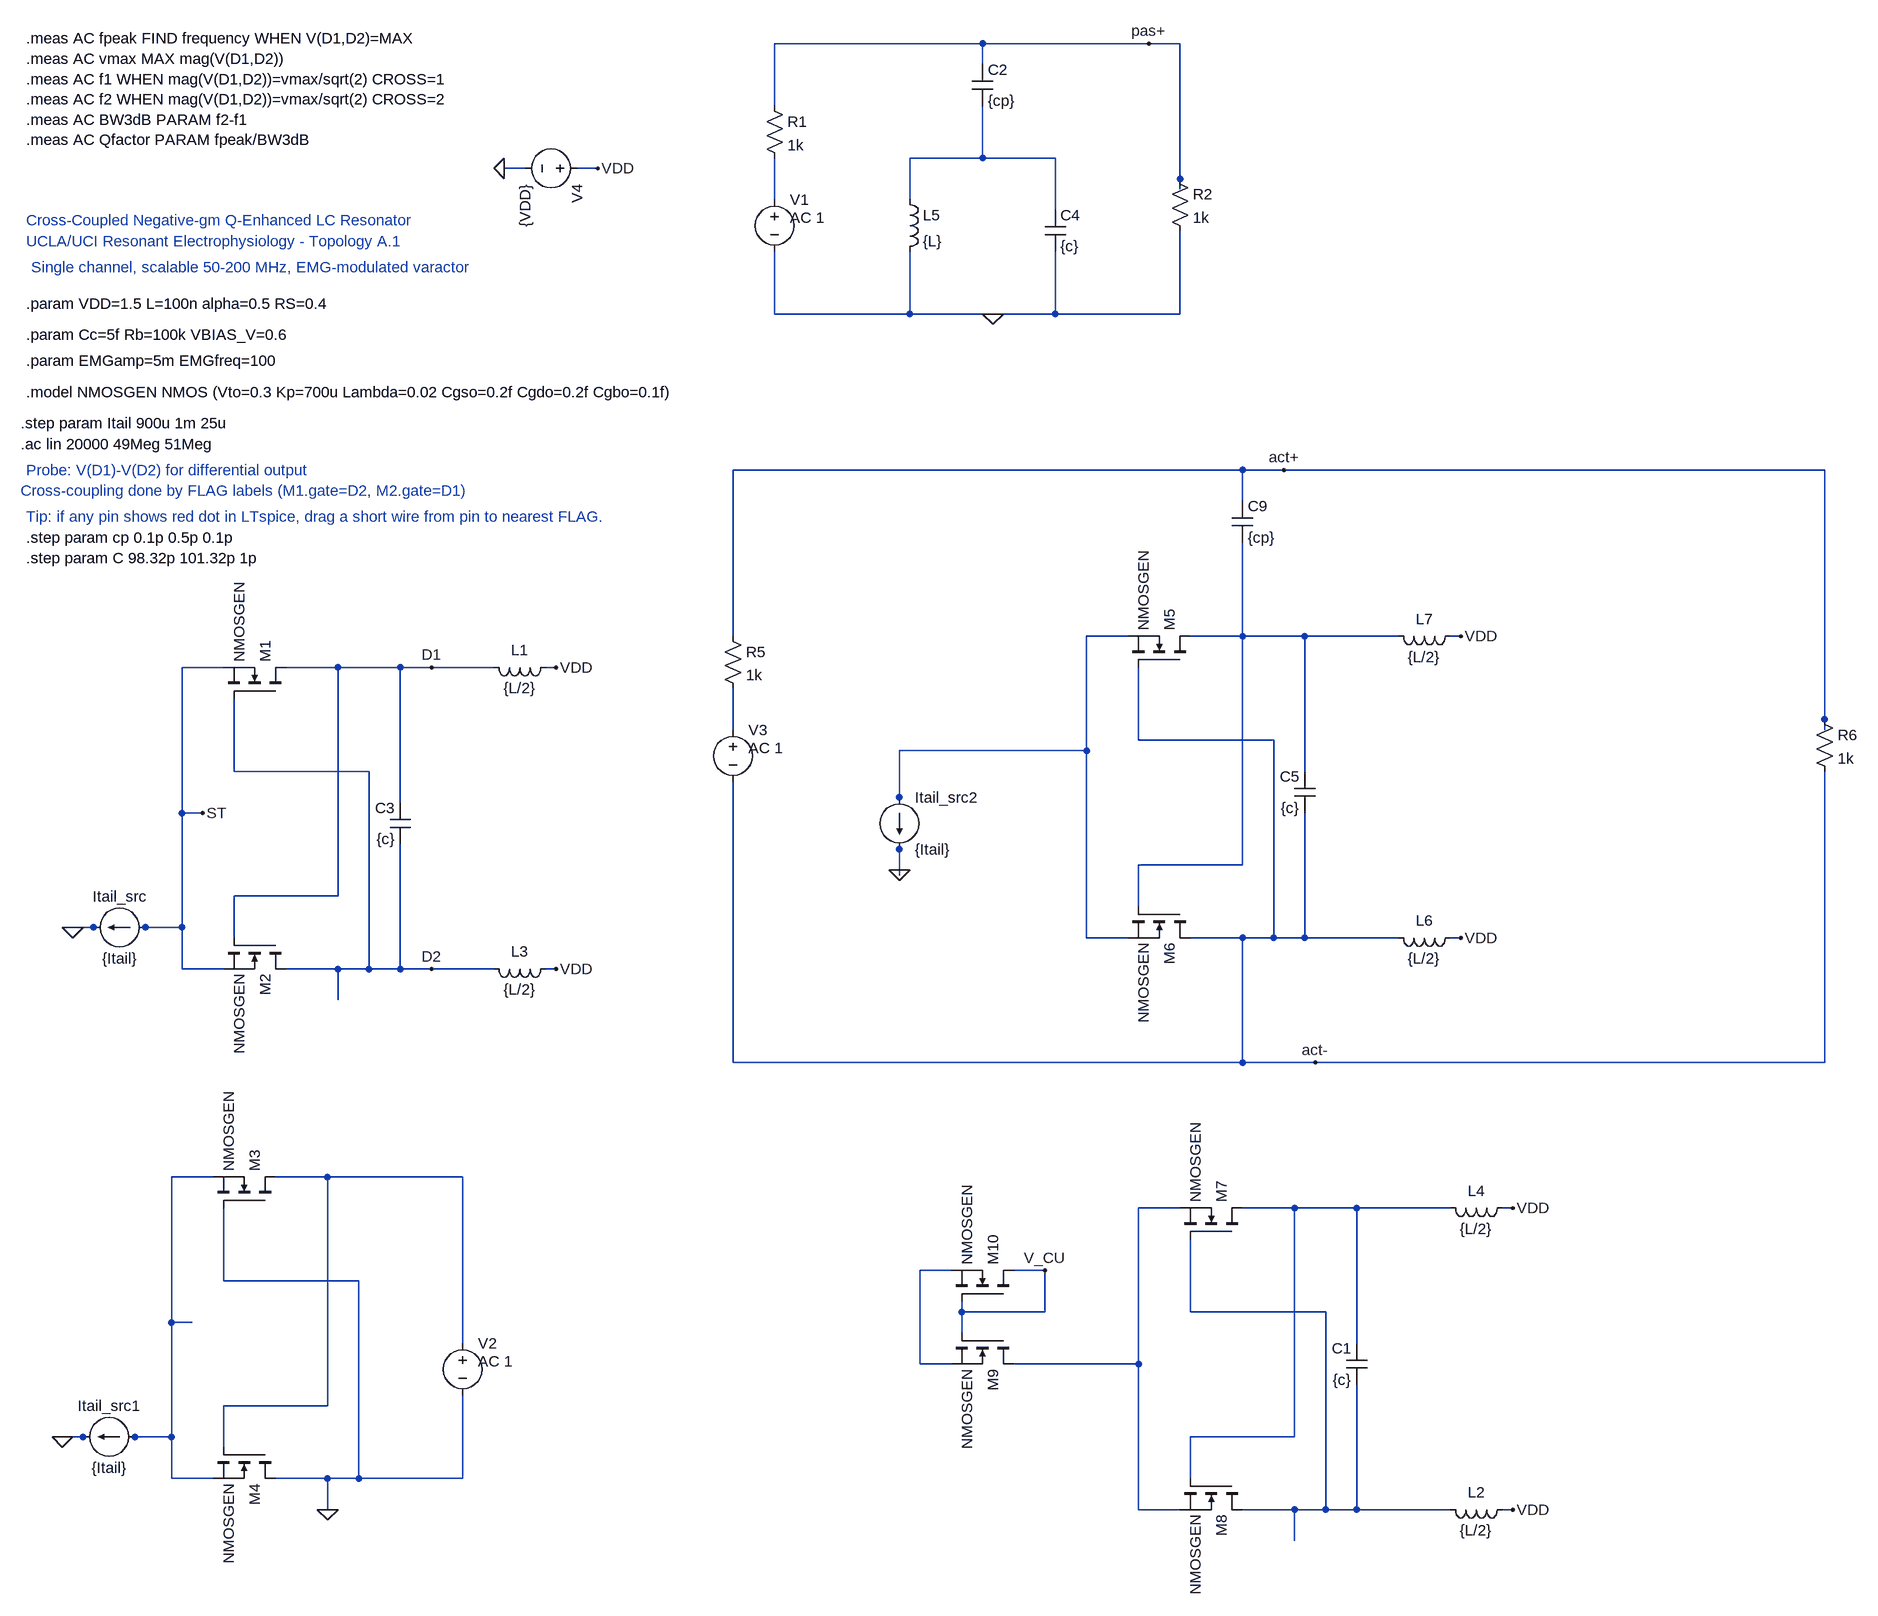
[diagram p0: schematic CROSS COUPLED_work_unique.asc]
CROSS COUPLED_work_unique.asc, the LTspice schematic file:
Version 4.1
SHEET 1 5816 1304
WIRE 368 -1472 48 -1472
WIRE 624 -1472 368 -1472
WIRE 672 -1472 624 -1472
WIRE 368 -1440 368 -1472
WIRE 48 -1376 48 -1472
WIRE 368 -1296 368 -1376
WIRE 368 -1296 256 -1296
WIRE 480 -1296 368 -1296
WIRE -336 -1280 -368 -1280
WIRE -224 -1280 -256 -1280
WIRE 672 -1264 672 -1472
WIRE 672 -1248 672 -1264
WIRE 48 -1232 48 -1296
WIRE 256 -1232 256 -1296
WIRE 480 -1216 480 -1296
WIRE 48 -1056 48 -1152
WIRE 256 -1056 256 -1152
WIRE 256 -1056 48 -1056
WIRE 384 -1056 256 -1056
WIRE 480 -1056 480 -1152
WIRE 480 -1056 384 -1056
WIRE 672 -1056 672 -1184
WIRE 672 -1056 480 -1056
WIRE 768 -816 -16 -816
WIRE 832 -816 768 -816
WIRE 1664 -816 832 -816
WIRE 768 -768 768 -816
WIRE -16 -560 -16 -816
WIRE 592 -560 528 -560
WIRE 768 -560 768 -704
WIRE 768 -560 688 -560
WIRE 864 -560 768 -560
WIRE 1008 -560 864 -560
WIRE 1104 -560 1088 -560
WIRE -800 -512 -864 -512
WIRE -624 -512 -704 -512
WIRE -528 -512 -624 -512
WIRE -480 -512 -528 -512
WIRE -384 -512 -480 -512
WIRE -288 -512 -304 -512
WIRE 1664 -432 1664 -816
WIRE -16 -416 -16 -480
WIRE 1664 -416 1664 -432
WIRE 608 -400 608 -512
WIRE 816 -400 608 -400
WIRE 528 -384 528 -560
WIRE 528 -384 240 -384
WIRE -784 -352 -784 -464
WIRE -576 -352 -784 -352
WIRE 864 -352 864 -560
WIRE 240 -312 240 -384
WIRE -528 -304 -528 -512
WIRE 240 -304 240 -312
WIRE -864 -288 -864 -512
WIRE -832 -288 -864 -288
WIRE 240 -232 240 -240
WIRE 768 -208 768 -560
WIRE 768 -208 608 -208
WIRE 240 -200 240 -232
WIRE 240 -192 240 -200
WIRE -624 -160 -624 -512
WIRE -624 -160 -784 -160
WIRE 608 -144 608 -208
WIRE -1032 -112 -1040 -112
WIRE -1000 -112 -1032 -112
WIRE -992 -112 -1000 -112
WIRE -920 -112 -928 -112
WIRE -864 -112 -864 -288
WIRE -864 -112 -920 -112
WIRE -784 -96 -784 -160
WIRE 528 -96 528 -384
WIRE 592 -96 528 -96
WIRE 768 -96 688 -96
WIRE 816 -96 816 -400
WIRE 816 -96 768 -96
WIRE 864 -96 864 -288
WIRE 864 -96 816 -96
WIRE 1008 -96 864 -96
WIRE 1104 -96 1088 -96
WIRE -864 -48 -864 -112
WIRE -800 -48 -864 -48
WIRE -624 -48 -704 -48
WIRE -576 -48 -576 -352
WIRE -576 -48 -624 -48
WIRE -528 -48 -528 -240
WIRE -528 -48 -576 -48
WIRE -480 -48 -528 -48
WIRE -384 -48 -480 -48
WIRE -288 -48 -304 -48
WIRE -624 0 -624 -48
WIRE -16 96 -16 -336
WIRE 768 96 768 -96
WIRE 768 96 -16 96
WIRE 880 96 768 96
WIRE 1664 96 1664 -352
WIRE 1664 96 880 96
WIRE -816 272 -880 272
WIRE -640 272 -720 272
WIRE -432 272 -640 272
WIRE 672 320 608 320
WIRE 848 320 768 320
WIRE 944 320 848 320
WIRE 1088 320 944 320
WIRE 1184 320 1168 320
WIRE 320 416 272 416
WIRE 464 416 416 416
WIRE -800 432 -800 320
WIRE -592 432 -800 432
WIRE 336 480 336 464
WIRE 464 480 464 416
WIRE 464 480 336 480
WIRE 688 480 688 368
WIRE 896 480 688 480
WIRE -880 496 -880 272
WIRE -848 496 -880 496
WIRE 336 512 336 480
WIRE -432 528 -432 272
WIRE 944 528 944 320
WIRE 272 560 272 416
WIRE 320 560 272 560
WIRE 608 560 608 320
WIRE 608 560 416 560
WIRE -640 624 -640 272
WIRE -640 624 -800 624
WIRE -1048 672 -1056 672
WIRE -1016 672 -1048 672
WIRE -1008 672 -1016 672
WIRE -936 672 -944 672
WIRE -880 672 -880 496
WIRE -880 672 -936 672
WIRE 848 672 848 320
WIRE 848 672 688 672
WIRE -800 688 -800 624
WIRE -880 736 -880 672
WIRE -816 736 -880 736
WIRE -640 736 -720 736
WIRE -592 736 -592 432
WIRE -592 736 -640 736
WIRE -432 736 -432 608
WIRE -432 736 -592 736
WIRE 688 736 688 672
WIRE -640 784 -640 736
WIRE 608 784 608 560
WIRE 672 784 608 784
WIRE 848 784 768 784
WIRE 896 784 896 480
WIRE 896 784 848 784
WIRE 944 784 944 592
WIRE 944 784 896 784
WIRE 1088 784 944 784
WIRE 1184 784 1168 784
WIRE 848 832 848 784
FLAG -1032 -112 0
FLAG -288 -48 VDD
FLAG -288 -512 VDD
FLAG -480 -48 D2
FLAG -480 -512 D1
FLAG -832 -288 ST
FLAG -224 -1280 VDD
FLAG -368 -1280 0
FLAG 1104 -96 VDD
FLAG 1104 -560 VDD
FLAG 240 -200 0
FLAG 832 -816 act+
FLAG 880 96 act-
FLAG 624 -1472 pas+
FLAG 384 -1056 0
FLAG -1048 672 0
FLAG -640 784 0
FLAG 1184 784 VDD
FLAG 1184 320 VDD
FLAG 464 416 V_CU
SYMBOL current -920 -112 R90
WINDOW 0 -32 40 VBottom 2
WINDOW 3 32 40 VTop 2
SYMATTR InstName Itail_src
SYMATTR Value {Itail}
SYMBOL nmos -704 -464 M270
SYMATTR InstName M1
SYMATTR Value NMOSGEN
SYMBOL nmos -704 -96 R90
SYMATTR InstName M2
SYMATTR Value NMOSGEN
SYMBOL ind -288 -64 R90
WINDOW 0 5 56 VBottom 2
WINDOW 3 32 56 VTop 2
SYMATTR InstName L3
SYMATTR Value {L/2}
SYMATTR SpiceLine Rser={RS/2}
SYMBOL ind -288 -528 R90
WINDOW 0 5 56 VBottom 2
WINDOW 3 32 56 VTop 2
SYMATTR InstName L1
SYMATTR Value {L/2}
SYMATTR SpiceLine Rser={RS/2}
SYMBOL cap -512 -240 R180
WINDOW 0 24 56 Left 2
WINDOW 3 24 8 Left 2
SYMATTR InstName C3
SYMATTR Value {c}
SYMBOL voltage -240 -1280 R90
WINDOW 123 0 0 Left 0
WINDOW 39 0 0 Left 0
SYMATTR InstName V4
SYMATTR Value {VDD}
SYMBOL voltage 48 -1248 R0
WINDOW 123 24 44 Left 2
WINDOW 39 0 0 Left 0
SYMATTR Value2 AC 1
SYMATTR InstName V1
SYMATTR Value ""
SYMBOL res 32 -1392 R0
SYMATTR InstName R1
SYMATTR Value 1k
SYMBOL cap 352 -1440 R0
SYMATTR InstName C2
SYMATTR Value {cp}
SYMBOL cap 464 -1216 R0
SYMATTR InstName C4
SYMATTR Value {c}
SYMBOL ind 240 -1248 R0
SYMATTR InstName L5
SYMATTR Value {L}
SYMATTR SpiceLine Rser=1
SYMBOL res 656 -1280 R0
SYMATTR InstName R2
SYMATTR Value 1k
SYMBOL nmos 688 -512 M270
SYMATTR InstName M5
SYMATTR Value NMOSGEN
SYMBOL nmos 688 -144 R90
SYMATTR InstName M6
SYMATTR Value NMOSGEN
SYMBOL ind 1104 -112 R90
WINDOW 0 5 56 VBottom 2
WINDOW 3 32 56 VTop 2
SYMATTR InstName L6
SYMATTR Value {L/2}
SYMATTR SpiceLine Rser={RS/2}
SYMBOL ind 1104 -576 R90
WINDOW 0 5 56 VBottom 2
WINDOW 3 32 56 VTop 2
SYMATTR InstName L7
SYMATTR Value {L/2}
SYMATTR SpiceLine Rser={RS/2}
SYMBOL cap 880 -288 R180
WINDOW 0 24 56 Left 2
WINDOW 3 24 8 Left 2
SYMATTR InstName C5
SYMATTR Value {c}
SYMBOL voltage -16 -432 R0
WINDOW 123 24 44 Left 2
WINDOW 39 0 0 Left 0
SYMATTR Value2 AC 1
SYMATTR InstName V3
SYMATTR Value ""
SYMBOL res -32 -576 R0
SYMATTR InstName R5
SYMATTR Value 1k
SYMBOL cap 752 -768 R0
SYMATTR InstName C9
SYMATTR Value {cp}
SYMBOL res 1648 -448 R0
SYMATTR InstName R6
SYMATTR Value 1k
SYMBOL current 240 -312 R0
SYMATTR InstName Itail_src2
SYMATTR Value {Itail}
SYMBOL current -936 672 R90
WINDOW 0 -32 40 VBottom 2
WINDOW 3 32 40 VTop 2
SYMATTR InstName Itail_src1
SYMATTR Value {Itail}
SYMBOL nmos -720 320 M270
SYMATTR InstName M3
SYMATTR Value NMOSGEN
SYMBOL nmos -720 688 R90
SYMATTR InstName M4
SYMATTR Value NMOSGEN
SYMBOL voltage -432 512 R0
WINDOW 123 24 44 Left 2
WINDOW 39 0 0 Left 0
SYMATTR Value2 AC 1
SYMATTR InstName V2
SYMATTR Value ""
SYMBOL nmos 768 368 M270
SYMATTR InstName M7
SYMATTR Value NMOSGEN
SYMBOL nmos 768 736 R90
SYMATTR InstName M8
SYMATTR Value NMOSGEN
SYMBOL ind 1184 768 R90
WINDOW 0 5 56 VBottom 2
WINDOW 3 32 56 VTop 2
SYMATTR InstName L2
SYMATTR Value {L/2}
SYMATTR SpiceLine Rser={RS/2}
SYMBOL ind 1184 304 R90
WINDOW 0 5 56 VBottom 2
WINDOW 3 32 56 VTop 2
SYMATTR InstName L4
SYMATTR Value {L/2}
SYMATTR SpiceLine Rser={RS/2}
SYMBOL cap 960 592 R180
WINDOW 0 24 56 Left 2
WINDOW 3 24 8 Left 2
SYMATTR InstName C1
SYMATTR Value {c}
SYMBOL nmos 416 512 R90
SYMATTR InstName M9
SYMATTR Value NMOSGEN
SYMBOL nmos 416 464 M270
SYMATTR InstName M10
SYMATTR Value NMOSGEN
TEXT -1104 -1200 Left 2 ;Cross-Coupled Negative-gm Q-Enhanced LC Resonator
TEXT -1104 -1168 Left 2 ;UCLA/UCI Resonant Electrophysiology - Topology A.1
TEXT -1096 -1128 Left 2 ;Single channel, scalable 50-200 MHz, EMG-modulated varactor
TEXT -1104 -1072 Left 2 !.param VDD=1.5 L=100n alpha=0.5 RS=0.4
TEXT -1104 -1024 Left 2 !.param Cc=5f Rb=100k VBIAS_V=0.6
TEXT -1104 -984 Left 2 !.param EMGamp=5m EMGfreq=100
TEXT -1104 -936 Left 2 !.model NMOSGEN NMOS (Vto=0.3 Kp=700u Lambda=0.02 Cgso=0.2f Cgdo=0.2f Cgbo=0.1f)
TEXT -1112 -888 Left 2 !.step param Itail 900u 1m 25u
TEXT -1104 -816 Left 2 ;Probe: V(D1)-V(D2) for differential output
TEXT -1112 -784 Left 2 ;Cross-coupling done by FLAG labels (M1.gate=D2, M2.gate=D1)
TEXT -1104 -744 Left 2 ;Tip: if any pin shows red dot in LTspice, drag a short wire from pin to nearest FLAG.
TEXT -1112 -856 Left 2 !.ac lin 20000 49Meg 51Meg
TEXT -1104 -712 Left 2 !.step param cp 0.1p 0.5p 0.1p
TEXT -1104 -1480 Left 2 !.meas AC fpeak FIND frequency WHEN V(D1,D2)=MAX\n.meas AC vmax MAX mag(V(D1,D2))\n.meas AC f1 WHEN mag(V(D1,D2))=vmax/sqrt(2) CROSS=1\n.meas AC f2 WHEN mag(V(D1,D2))=vmax/sqrt(2) CROSS=2\n.meas AC BW3dB PARAM f2-f1\n.meas AC Qfactor PARAM fpeak/BW3dB
TEXT -1104 -680 Left 2 !.step param C 98.32p 101.32p 1p

The netlist it stands for:
* CROSS COUPLED_work_unique.asc
Itail_src ST 0 {Itail}
M1 D1 D2 ST ST NMOSGEN
M2 D2 D1 ST ST NMOSGEN
L3 VDD D2 {L/2} Rser={RS/2}
L1 VDD D1 {L/2} Rser={RS/2}
C3 D2 D1 {c}
V4 VDD 0 {VDD}
V1 N002 0 AC 1
R1 pas+ N002 1k
C2 pas+ N001 {cp}
C4 N001 0 {c}
L5 N001 0 {L} Rser=1
R2 pas+ 0 1k
M5 N004 act- N003 N003 NMOSGEN
M6 act- N004 N003 N003 NMOSGEN
L6 VDD act- {L/2} Rser={RS/2}
L7 VDD N004 {L/2} Rser={RS/2}
C5 act- N004 {c}
V3 N005 act- AC 1
R5 act+ N005 1k
C9 act+ N004 {cp}
R6 act+ act- 1k
Itail_src2 N003 0 {Itail}
Itail_src1 N006 0 {Itail}
M3 N007 0 N006 N006 NMOSGEN
M4 0 N007 N006 N006 NMOSGEN
V2 N007 0 AC 1
M7 N009 N011 N008 N008 NMOSGEN
M8 N011 N009 N008 N008 NMOSGEN
L2 VDD N011 {L/2} Rser={RS/2}
L4 VDD N009 {L/2} Rser={RS/2}
C1 N011 N009 {c}
M9 N008 V_CU N010 N010 NMOSGEN
M10 V_CU V_CU N010 N010 NMOSGEN
.model NMOS NMOS
.model PMOS PMOS
.lib standard.mos
* Cross-Coupled Negative-gm Q-Enhanced LC Resonator
* UCLA/UCI Resonant Electrophysiology - Topology A.1
* Single channel, scalable 50-200 MHz, EMG-modulated varactor
.param VDD=1.5 L=100n alpha=0.5 RS=0.4
.param Cc=5f Rb=100k VBIAS_V=0.6
.param EMGamp=5m EMGfreq=100
.model NMOSGEN NMOS (Vto=0.3 Kp=700u Lambda=0.02 Cgso=0.2f Cgdo=0.2f Cgbo=0.1f)
.step param Itail 900u 1m 25u
* Probe: V(D1)-V(D2) for differential output
* Cross-coupling done by FLAG labels (M1.gate=D2, M2.gate=D1)
* Tip: if any pin shows red dot in LTspice, drag a short wire from pin to nearest FLAG.
.ac lin 20000 49Meg 51Meg
.step param cp 0.1p 0.5p 0.1p
.meas AC fpeak FIND frequency WHEN V(D1,D2)=MAX
.meas AC vmax MAX mag(V(D1,D2))
.meas AC f1 WHEN mag(V(D1,D2))=vmax/sqrt(2) CROSS=1
.meas AC f2 WHEN mag(V(D1,D2))=vmax/sqrt(2) CROSS=2
.meas AC BW3dB PARAM f2-f1
.meas AC Qfactor PARAM fpeak/BW3dB
.step param C 98.32p 101.32p 1p
.backanno
.end